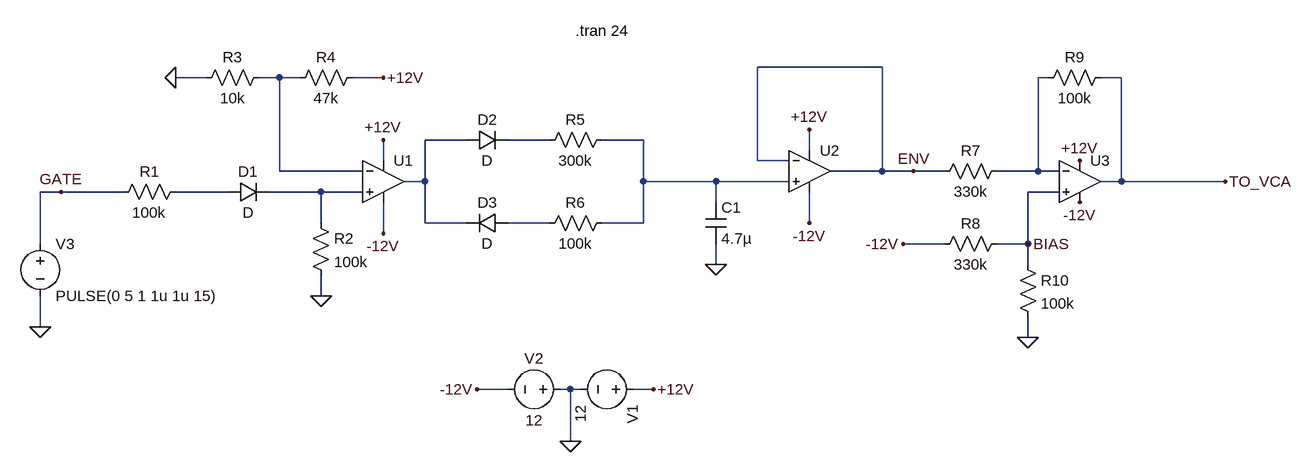
[diagram p0: schematic eg_ar.asc]
eg_ar.asc, the LTspice schematic file:
Version 4
SHEET 1 2212 680
WIRE 1216 -16 1024 -16
WIRE 176 0 128 0
WIRE 288 0 256 0
WIRE 320 0 288 0
WIRE 448 0 400 0
WIRE 1472 0 1456 0
WIRE 1584 0 1552 0
WIRE 576 96 512 96
WIRE 704 96 640 96
WIRE 848 96 784 96
WIRE 1104 112 1104 80
WIRE 448 128 448 96
WIRE 1024 128 1024 -16
WIRE 1072 128 1024 128
WIRE 288 144 288 0
WIRE 416 144 288 144
WIRE 1216 144 1216 -16
WIRE 1216 144 1136 144
WIRE 1264 144 1216 144
WIRE 1312 144 1264 144
WIRE 1456 144 1456 0
WIRE 1456 144 1392 144
WIRE 1488 144 1456 144
WIRE 512 160 512 96
WIRE 512 160 480 160
WIRE 848 160 848 96
WIRE 960 160 848 160
WIRE 1072 160 960 160
WIRE 1584 160 1584 0
WIRE 1584 160 1552 160
WIRE 1744 160 1584 160
WIRE -48 176 -80 176
WIRE 48 176 -48 176
WIRE 208 176 128 176
WIRE 352 176 272 176
WIRE 416 176 352 176
WIRE 1488 176 1440 176
WIRE 960 192 960 160
WIRE 352 224 352 176
WIRE 512 224 512 160
WIRE 576 224 512 224
WIRE 704 224 640 224
WIRE 848 224 848 160
WIRE 848 224 784 224
WIRE 1104 224 1104 176
WIRE 448 240 448 192
WIRE -80 256 -80 176
WIRE 1312 256 1248 256
WIRE 1440 256 1440 176
WIRE 1440 256 1392 256
WIRE 960 288 960 256
WIRE 1440 288 1440 256
WIRE 352 336 352 304
WIRE -80 384 -80 336
WIRE 1440 400 1440 368
WIRE 640 480 592 480
WIRE 736 480 720 480
WIRE 752 480 736 480
WIRE 864 480 832 480
WIRE 736 560 736 480
FLAG 736 560 0
FLAG 864 480 +12V
FLAG 592 480 -12V
FLAG 128 0 0
FLAG 448 0 +12V
FLAG 352 336 0
FLAG 448 96 +12V
FLAG 960 288 0
FLAG 1104 80 +12V
FLAG 1264 144 ENV
FLAG -80 384 0
FLAG -48 176 GATE
FLAG 1520 192 -12V
FLAG 1520 128 +12V
FLAG 448 240 -12V
FLAG 1104 224 -12V
FLAG 1440 400 0
FLAG 1248 256 -12V
FLAG 1744 160 TO_VCA
FLAG 1440 256 BIAS
SYMBOL res 144 160 R90
WINDOW 0 0 56 VBottom 2
WINDOW 3 32 56 VTop 2
SYMATTR InstName R1
SYMATTR Value 100k
SYMBOL diode 208 192 R270
WINDOW 0 32 32 VTop 2
WINDOW 3 0 32 VBottom 2
SYMATTR InstName D1
SYMBOL OpAmps\\UniversalOpamp2 448 160 R0
SYMATTR InstName U1
SYMBOL voltage 848 480 R90
WINDOW 123 0 0 Left 0
WINDOW 39 0 0 Left 0
SYMATTR InstName V1
SYMATTR Value 12
SYMBOL voltage 736 480 R90
WINDOW 0 -32 56 VBottom 2
WINDOW 3 32 56 VTop 2
SYMATTR InstName V2
SYMATTR Value 12
SYMBOL res 336 208 R0
SYMATTR InstName R2
SYMATTR Value 100k
SYMBOL res 272 -16 R90
WINDOW 0 0 56 VBottom 2
WINDOW 3 32 56 VTop 2
SYMATTR InstName R3
SYMATTR Value 10k
SYMBOL res 416 -16 R90
WINDOW 0 0 56 VBottom 2
WINDOW 3 32 56 VTop 2
SYMATTR InstName R4
SYMATTR Value 47k
SYMBOL diode 576 112 R270
WINDOW 0 32 32 VTop 2
WINDOW 3 0 32 VBottom 2
SYMATTR InstName D2
SYMBOL diode 640 208 R90
WINDOW 0 0 32 VBottom 2
WINDOW 3 32 32 VTop 2
SYMATTR InstName D3
SYMBOL res 800 80 R90
WINDOW 0 0 56 VBottom 2
WINDOW 3 32 56 VTop 2
SYMATTR InstName R5
SYMATTR Value 300k
SYMBOL res 800 208 R90
WINDOW 0 0 56 VBottom 2
WINDOW 3 32 56 VTop 2
SYMATTR InstName R6
SYMATTR Value 100k
SYMBOL cap 944 192 R0
SYMATTR InstName C1
SYMATTR Value 4.7µ
SYMBOL OpAmps\\UniversalOpamp2 1104 144 R0
SYMATTR InstName U2
SYMBOL voltage -80 240 R0
WINDOW 123 0 0 Left 0
WINDOW 39 0 0 Left 0
SYMATTR InstName V3
SYMATTR Value PULSE(0 5 1 1u 1u 15)
SYMBOL OpAmps\\UniversalOpamp2 1520 160 R0
SYMATTR InstName U3
SYMBOL res 1568 -16 R90
WINDOW 0 0 56 VBottom 2
WINDOW 3 32 56 VTop 2
SYMATTR InstName R9
SYMATTR Value 100k
SYMBOL res 1408 128 R90
WINDOW 0 0 56 VBottom 2
WINDOW 3 32 56 VTop 2
SYMATTR InstName R7
SYMATTR Value 330k
SYMBOL res 1408 240 R90
WINDOW 0 0 56 VBottom 2
WINDOW 3 32 56 VTop 2
SYMATTR InstName R8
SYMATTR Value 330k
SYMBOL res 1424 272 R0
SYMATTR InstName R10
SYMATTR Value 100k
TEXT 744 -72 Left 2 !.tran 24

The netlist it stands for:
* eg_ar.asc
R1 N006 GATE 100k
D1 N006 N007 D
XU1 N007 N001 +12V -12V N003 level.2 Avol=1Meg GBW=10Meg Slew=10Meg ilimit=25m rail=0 Vos=0 phimargin=45 en=0 enk=0 in=0 ink=0 Rin=500Meg  ; pins IN+ IN- V+ V- OUT
V1 +12V 0 12
V2 0 -12V 12
R2 N007 0 100k
R3 N001 0 10k
R4 +12V N001 47k
D2 N003 N004 D
D3 N008 N003 D
R5 N005 N004 300k
R6 N005 N008 100k
C1 N005 0 4.7µ
XU2 N005 ENV +12V -12V ENV level.2 Avol=1Meg GBW=10Meg Slew=10Meg ilimit=25m rail=0 Vos=0 phimargin=45 en=0 enk=0 in=0 ink=0 Rin=500Meg  ; pins IN+ IN- V+ V- OUT
V3 GATE 0 PULSE(0 5 1 1u 1u 15)
XU3 BIAS N002 +12V -12V TO_VCA level.2 Avol=1Meg GBW=10Meg Slew=10Meg ilimit=25m rail=0 Vos=0 phimargin=45 en=0 enk=0 in=0 ink=0 Rin=500Meg  ; pins IN+ IN- V+ V- OUT
R9 TO_VCA N002 100k
R7 N002 ENV 330k
R8 BIAS -12V 330k
R10 BIAS 0 100k
.model D D
.lib standard.dio
.tran 24
.lib UniversalOpamps2.sub
.backanno
.end